# Altium schematic sheet BoardTop.SchDoc
size A3; SheetNumber: 1; SheetTotal: 15
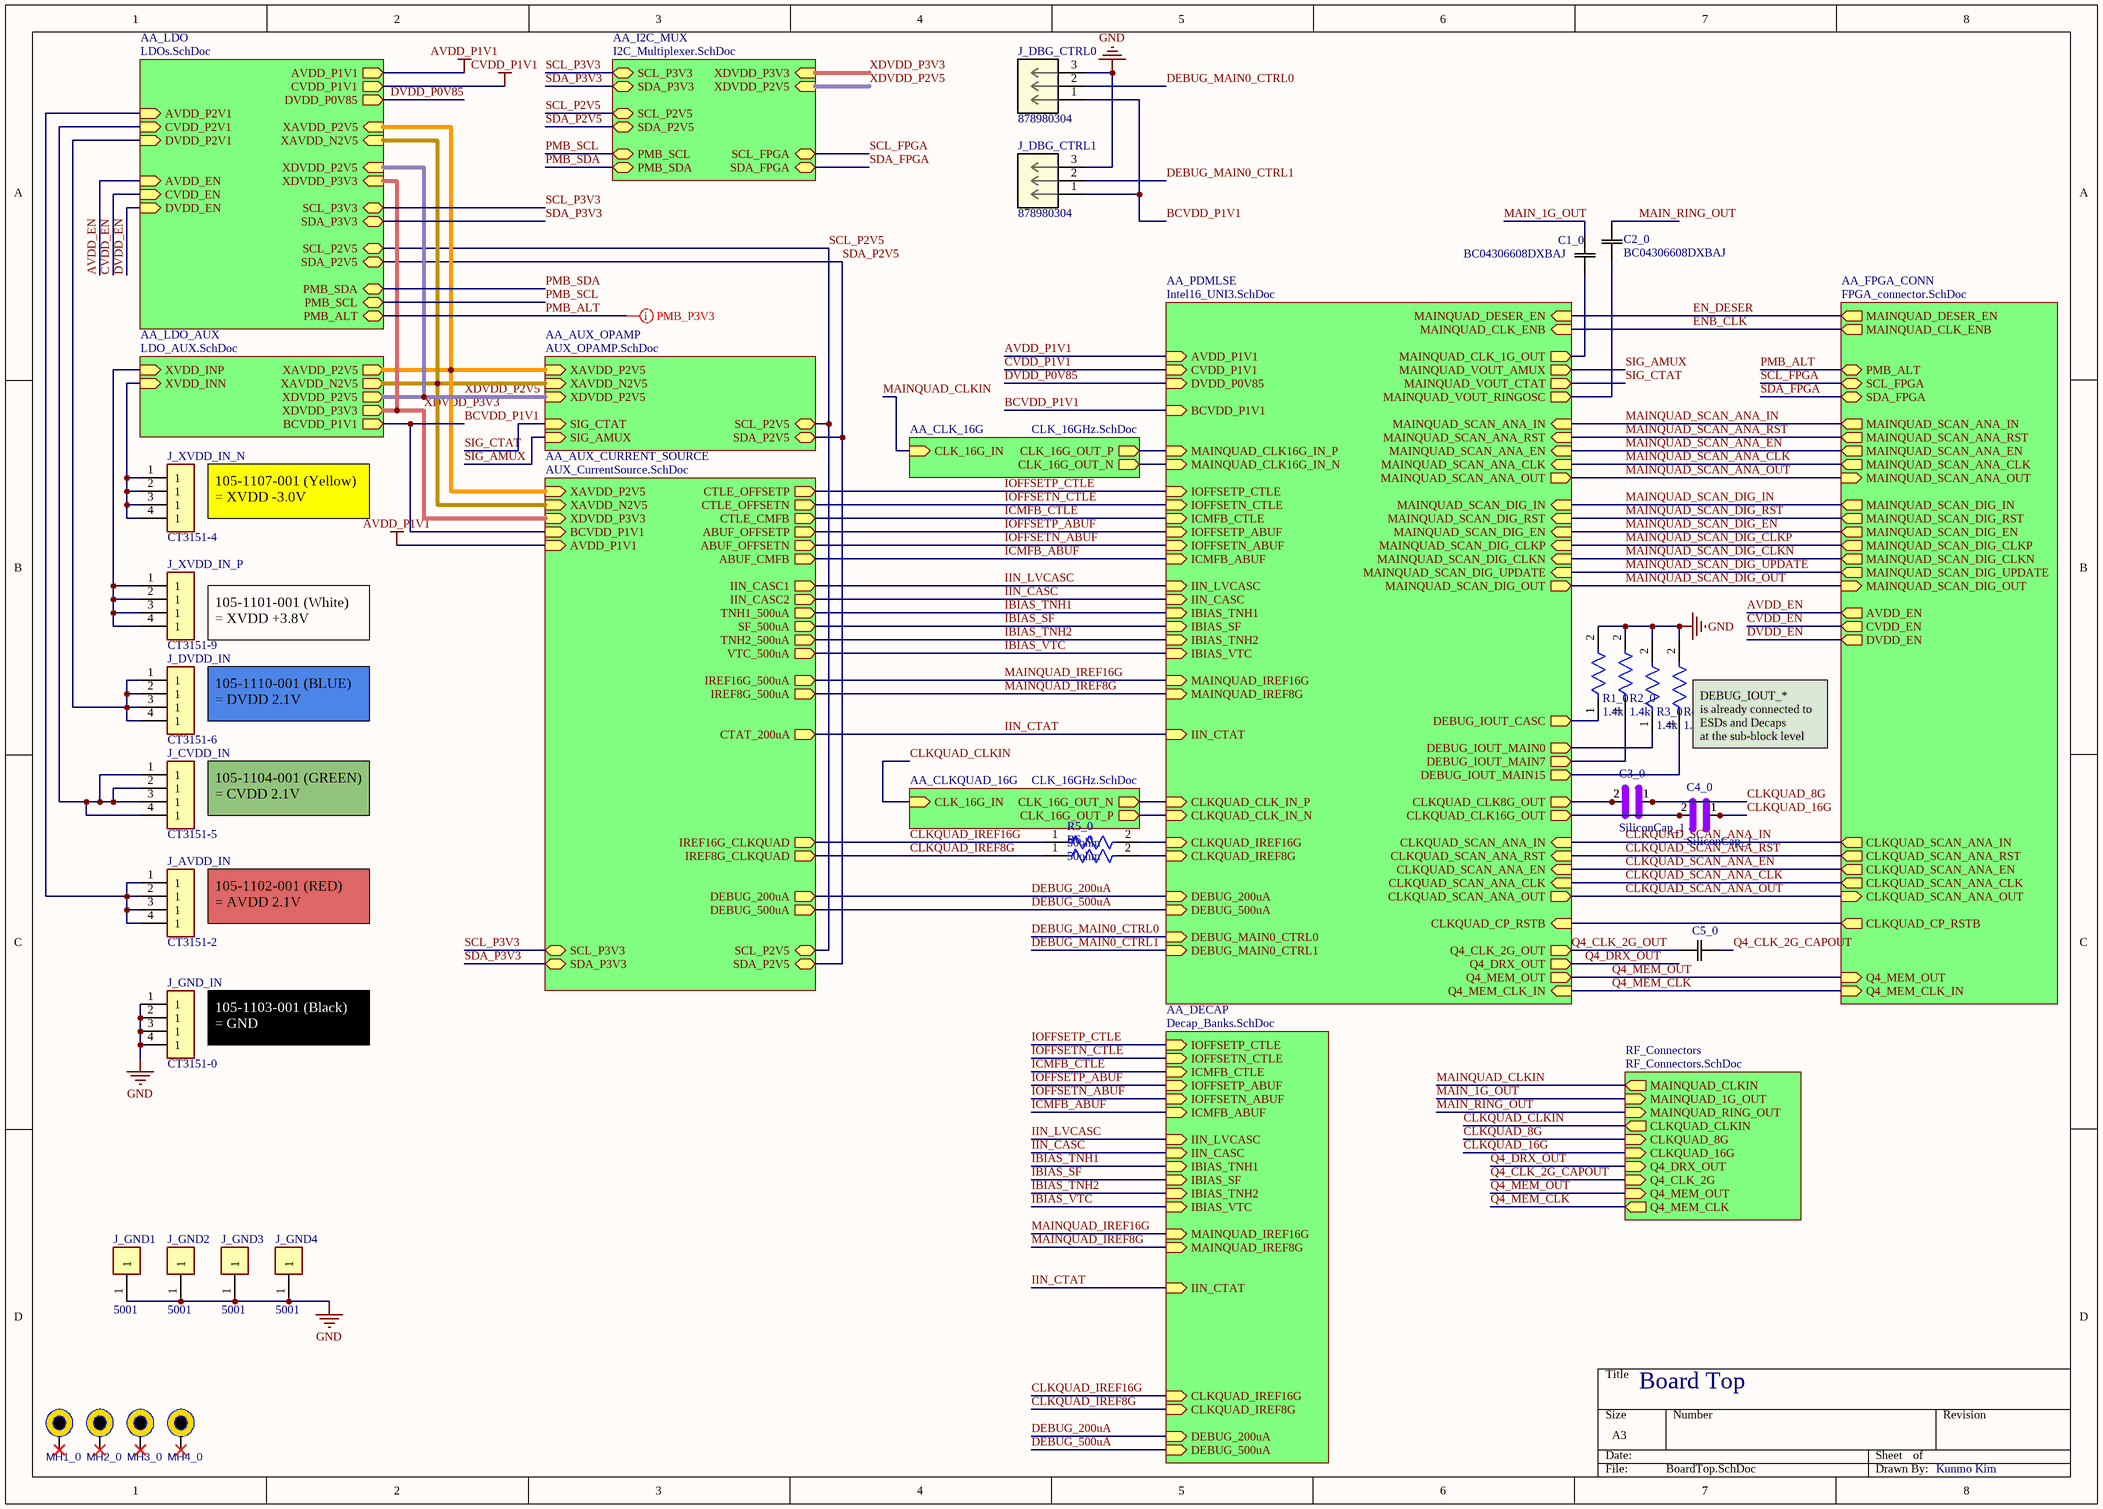
[diagram p0: BoardTop.SchDoc]

## Parts
C1_0  BC04306608DXBAJ  [CAP_BC04_VIS]
C2_0  BC04306608DXBAJ  [CAP_BC04_VIS]
C3_0  SiliconCap_1  [0201-NOSILK]
C4_0  SiliconCap_1  [0201-NOSILK]
C5_0  BC04306608DXBAJ  [CAP_BC04_VIS]  (value not drawn)
J_AVDD_IN  CT3151-2  [CALTEST_CT3151-2]
J_CVDD_IN  CT3151-5  [CALTEST_CT3151-2]
J_DBG_CTRL0  878980304  [CONN03_87898_M-5p84_MOL]
J_DBG_CTRL1  878980304  [CONN03_87898_M-5p84_MOL]
J_DVDD_IN  CT3151-6  [CALTEST_CT3151-2]
J_GND1  5001  [FP-5001-MFG]
J_GND2  5001  [FP-5001-MFG]
J_GND3  5001  [FP-5001-MFG]
J_GND4  5001  [FP-5001-MFG]
J_GND_IN  CT3151-0  [CALTEST_CT3151-0]
J_XVDD_IN_N  CT3151-4  [CALTEST_CT3151-2]
J_XVDD_IN_P  CT3151-9  [CALTEST_CT3151-2]
MH1_0  MTG  [MTG-3.2/6.5-PTH]  (value not drawn)
MH2_0  MTG  [MTG-3.2/6.5-PTH]  (value not drawn)
MH3_0  MTG  [MTG-3.2/6.5-PTH]  (value not drawn)
MH4_0  MTG  [MTG-3.2/6.5-PTH]  (value not drawn)
R1_0  1.4k  [FP-CRCW1206-e3-IPC_B]
R2_0  1.4k  [FP-CRCW1206-e3-IPC_B]
R3_0  1.4k  [FP-CRCW1206-e3-IPC_B]
R4_0  1.4k  [FP-CRCW1206-e3-IPC_B]
R5_0  50ohm  [FP-RT0402-0_35-IPC_A]
R6_0  50ohm  [FP-RT0402-0_35-IPC_A]

## Sub-sheets
AA_AUX_CURRENT_SOURCE = AUX_CurrentSource.SchDoc: BCVDD_P1V1 (in), XAVDD_N2V5 (in), XAVDD_P2V5 (in), CTLE_CMFB (out), TNH1_500uA (out), IREF8G_500uA (out), ABUF_CMFB (out), IREF16G_500uA (out), SF_500uA (out), IIN_CASC1 (out), TNH2_500uA (out), IIN_CASC2 (out), ABUF_OFFSETN (out), ABUF_OFFSETP (out), VTC_500uA (out), CTAT_200uA (out), CTLE_OFFSETN (out), CTLE_OFFSETP (out), XDVDD_P3V3 (in), SCL_P2V5 (bidir), SDA_P2V5 (bidir), DEBUG_500uA (out), DEBUG_200uA (out), IREF16G_CLKQUAD (out), IREF8G_CLKQUAD (out), AVDD_P1V1 (in), SCL_P3V3 (bidir), SDA_P3V3 (bidir)
AA_AUX_OPAMP = AUX_OPAMP.SchDoc: XDVDD_P2V5 (in), XAVDD_P2V5 (in), XAVDD_N2V5 (in), SCL_P2V5 (bidir), SDA_P2V5 (bidir), SIG_AMUX (in), SIG_CTAT (in)
AA_CLK_16G = CLK_16GHz.SchDoc: CLK_16G_OUT_P (out), CLK_16G_IN (in), CLK_16G_OUT_N (out)
AA_CLKQUAD_16G = CLK_16GHz.SchDoc: CLK_16G_OUT_P (out), CLK_16G_IN (in), CLK_16G_OUT_N (out)
AA_DECAP = Decap_Banks.SchDoc: DEBUG_500uA (in), CLKQUAD_IREF8G (in), IIN_CTAT (in), MAINQUAD_IREF16G (in), ICMFB_ABUF (in), IOFFSETN_ABUF (in), IOFFSETP_ABUF (in), ICMFB_CTLE (in), IOFFSETN_CTLE (in), IOFFSETP_CTLE (in), IIN_LVCASC (in), IIN_CASC (in), IBIAS_TNH1 (in), IBIAS_SF (in), IBIAS_TNH2 (in), IBIAS_VTC (in), MAINQUAD_IREF8G (in), CLKQUAD_IREF16G (in), DEBUG_200uA (in)
AA_FPGA_CONN = FPGA_connector.SchDoc: MAINQUAD_SCAN_ANA_IN (out), MAINQUAD_SCAN_ANA_RST (out), MAINQUAD_SCAN_ANA_EN (out), MAINQUAD_SCAN_ANA_CLK (out), MAINQUAD_SCAN_ANA_OUT (in), MAINQUAD_SCAN_DIG_IN (out), MAINQUAD_SCAN_DIG_RST (out), MAINQUAD_SCAN_DIG_EN (out), MAINQUAD_SCAN_DIG_CLKP (out), MAINQUAD_SCAN_DIG_CLKN (out), MAINQUAD_SCAN_DIG_UPDATE (out), MAINQUAD_SCAN_DIG_OUT (in), CLKQUAD_SCAN_ANA_EN (out), CLKQUAD_SCAN_ANA_RST (out), CLKQUAD_SCAN_ANA_CLK (out), CLKQUAD_SCAN_ANA_IN (out), CLKQUAD_SCAN_ANA_OUT (in), Q4_MEM_OUT (in), Q4_MEM_CLK_IN (in), AVDD_EN (out), CVDD_EN (out), DVDD_EN (out), SCL_FPGA (bidir), SDA_FPGA (bidir), PMB_ALT (bidir), CLKQUAD_CP_RSTB (out), MAINQUAD_DESER_EN (out), MAINQUAD_CLK_ENB (out)
AA_I2C_MUX = I2C_Multiplexer.SchDoc: SCL_P3V3 (bidir), SDA_P3V3 (bidir), SCL_P2V5 (bidir), SDA_P2V5 (bidir), PMB_SCL (bidir), PMB_SDA (bidir), SCL_FPGA (bidir), SDA_FPGA (bidir), XDVDD_P3V3 (in), XDVDD_P2V5 (in)
AA_LDO = LDOs.SchDoc: XAVDD_P2V5 (in), XDVDD_P3V3 (in), XAVDD_N2V5 (in), XDVDD_P2V5 (in), AVDD_P2V1 (in), AVDD_EN (in), SCL_P2V5 (bidir), SDA_P2V5 (bidir), CVDD_P1V1 (out), CVDD_P2V1 (in), CVDD_EN (in), DVDD_P0V85 (out), DVDD_EN (in), DVDD_P2V1 (in), PMB_SDA (bidir), PMB_SCL (bidir), PMB_ALT (bidir), SCL_P3V3 (bidir), SDA_P3V3 (bidir), AVDD_P1V1 (out)
AA_LDO_AUX = LDO_AUX.SchDoc: XAVDD_P2V5 (out), XVDD_INN (in), XVDD_INP (in), XAVDD_N2V5 (out), XDVDD_P2V5 (out), XDVDD_P3V3 (out), BCVDD_P1V1 (out)
AA_PDMLSE = Intel16_UNI3.SchDoc: Q4_CLK_2G_OUT (out), Q4_DRX_OUT (out), Q4_MEM_OUT (out), CLKQUAD_CLK8G_OUT (out), CLKQUAD_CLK16G_OUT (out), CLKQUAD_CP_RSTB (in), CLKQUAD_SCAN_ANA_EN (in), CLKQUAD_SCAN_ANA_RST (in), CLKQUAD_SCAN_ANA_CLK (in), CLKQUAD_SCAN_ANA_IN (in), CLKQUAD_SCAN_ANA_OUT (out), MAINQUAD_VOUT_AMUX (out), MAINQUAD_CLK_1G_OUT (out), MAINQUAD_VOUT_CTAT (out), MAINQUAD_VOUT_RINGOSC (out), MAINQUAD_SCAN_ANA_IN (in), MAINQUAD_SCAN_ANA_RST (in), MAINQUAD_SCAN_ANA_EN (in), MAINQUAD_SCAN_ANA_CLK (in), MAINQUAD_SCAN_ANA_OUT (out), MAINQUAD_SCAN_DIG_IN (in), MAINQUAD_SCAN_DIG_RST (in), MAINQUAD_SCAN_DIG_EN (in), MAINQUAD_SCAN_DIG_CLKP (in), MAINQUAD_SCAN_DIG_CLKN (in), MAINQUAD_SCAN_DIG_UPDATE (in), MAINQUAD_SCAN_DIG_OUT (out), DVDD_P0V85 (in), Q4_MEM_CLK_IN (in), BCVDD_P1V1 (in), CLKQUAD_CLK_IN_P (in), CLKQUAD_CLK_IN_N (in), CLKQUAD_IREF8G (in), CLKQUAD_IREF16G (in), AVDD_P1V1 (in), CVDD_P1V1 (in), MAINQUAD_CLK16G_IN_P (in), MAINQUAD_CLK16G_IN_N (in), MAINQUAD_IREF8G (in), MAINQUAD_IREF16G (in), ICMFB_CTLE (in), IOFFSETP_CTLE (in), IOFFSETN_CTLE (in), ICMFB_ABUF (in), IOFFSETP_ABUF (in), IOFFSETN_ABUF (in), IIN_LVCASC (in), IIN_CASC (in), IBIAS_TNH1 (in), IBIAS_TNH2 (in), IBIAS_SF (in), IBIAS_VTC (in), IIN_CTAT (in), MAINQUAD_DESER_EN (in), DEBUG_200uA (in), DEBUG_500uA (in), DEBUG_MAIN0_CTRL0 (in), DEBUG_MAIN0_CTRL1 (in), DEBUG_IOUT_CASC (out), DEBUG_IOUT_MAIN0 (out), DEBUG_IOUT_MAIN7 (out), DEBUG_IOUT_MAIN15 (out), MAINQUAD_CLK_ENB (in)
RF_Connectors = RF_Connectors.SchDoc: MAINQUAD_CLKIN (out), MAINQUAD_1G_OUT (in), MAINQUAD_RING_OUT (in), CLKQUAD_CLKIN (out), CLKQUAD_8G (in), CLKQUAD_16G (in), Q4_DRX_OUT (in), Q4_CLK_2G (in), Q4_MEM_OUT (in), Q4_MEM_CLK (out)

## Nets
AVDD_P1V1: sheet AA_LDO/AVDD_P1V1, sheet AA_AUX_CURRENT_SOURCE/AVDD_P1V1, sheet AA_PDMLSE/AVDD_P1V1
CVDD_P1V1: sheet AA_LDO/CVDD_P1V1, sheet AA_PDMLSE/CVDD_P1V1
GND: J_DBG_CTRL0.3 J_DBG_CTRL1.3 J_GND1.1 J_GND2.1 J_GND3.1 J_GND4.1 J_GND_IN.1 J_GND_IN.2(1) J_GND_IN.3(1) J_GND_IN.4(1) R1_0.2 R2_0.2 R3_0.2 R4_0.2
AVDD_EN: sheet AA_LDO/AVDD_EN, sheet AA_FPGA_CONN/AVDD_EN
BCVDD_P1V1: J_DBG_CTRL0.1 J_DBG_CTRL1.1 ; sheet AA_LDO_AUX/BCVDD_P1V1, sheet AA_AUX_CURRENT_SOURCE/BCVDD_P1V1, sheet AA_PDMLSE/BCVDD_P1V1
CLKQUAD_8G: C3_0.1 ; sheet RF_Connectors/CLKQUAD_8G
CLKQUAD_16G: C4_0.1 ; sheet RF_Connectors/CLKQUAD_16G
CLKQUAD_CLKIN: sheet AA_CLKQUAD_16G/CLK_16G_IN, sheet RF_Connectors/CLKQUAD_CLKIN
CLKQUAD_IREF8G: R6_0.1 ; sheet AA_AUX_CURRENT_SOURCE/IREF8G_CLKQUAD, sheet AA_DECAP/CLKQUAD_IREF8G
CLKQUAD_IREF16G: R5_0.1 ; sheet AA_AUX_CURRENT_SOURCE/IREF16G_CLKQUAD, sheet AA_DECAP/CLKQUAD_IREF16G
CLKQUAD_SCAN_ANA_CLK: sheet AA_PDMLSE/CLKQUAD_SCAN_ANA_CLK, sheet AA_FPGA_CONN/CLKQUAD_SCAN_ANA_CLK
CLKQUAD_SCAN_ANA_EN: sheet AA_PDMLSE/CLKQUAD_SCAN_ANA_EN, sheet AA_FPGA_CONN/CLKQUAD_SCAN_ANA_EN
CLKQUAD_SCAN_ANA_IN: sheet AA_PDMLSE/CLKQUAD_SCAN_ANA_IN, sheet AA_FPGA_CONN/CLKQUAD_SCAN_ANA_IN
CLKQUAD_SCAN_ANA_OUT: sheet AA_PDMLSE/CLKQUAD_SCAN_ANA_OUT, sheet AA_FPGA_CONN/CLKQUAD_SCAN_ANA_OUT
CLKQUAD_SCAN_ANA_RST: sheet AA_PDMLSE/CLKQUAD_SCAN_ANA_RST, sheet AA_FPGA_CONN/CLKQUAD_SCAN_ANA_RST
CVDD_EN: sheet AA_LDO/CVDD_EN, sheet AA_FPGA_CONN/CVDD_EN
DEBUG_200uA: sheet AA_AUX_CURRENT_SOURCE/DEBUG_200uA, sheet AA_PDMLSE/DEBUG_200uA, sheet AA_DECAP/DEBUG_200uA
DEBUG_500uA: sheet AA_AUX_CURRENT_SOURCE/DEBUG_500uA, sheet AA_PDMLSE/DEBUG_500uA, sheet AA_DECAP/DEBUG_500uA
DEBUG_MAIN0_CTRL0: J_DBG_CTRL0.2 ; sheet AA_PDMLSE/DEBUG_MAIN0_CTRL0
DEBUG_MAIN0_CTRL1: J_DBG_CTRL1.2 ; sheet AA_PDMLSE/DEBUG_MAIN0_CTRL1
DVDD_EN: sheet AA_LDO/DVDD_EN, sheet AA_FPGA_CONN/DVDD_EN
DVDD_P0V85: sheet AA_LDO/DVDD_P0V85, sheet AA_PDMLSE/DVDD_P0V85
EN_DESER: sheet AA_PDMLSE/MAINQUAD_DESER_EN, sheet AA_FPGA_CONN/MAINQUAD_DESER_EN
ENB_CLK: sheet AA_PDMLSE/MAINQUAD_CLK_ENB, sheet AA_FPGA_CONN/MAINQUAD_CLK_ENB
IBIAS_SF: sheet AA_AUX_CURRENT_SOURCE/SF_500uA, sheet AA_PDMLSE/IBIAS_SF, sheet AA_DECAP/IBIAS_SF
IBIAS_TNH1: sheet AA_AUX_CURRENT_SOURCE/TNH1_500uA, sheet AA_PDMLSE/IBIAS_TNH1, sheet AA_DECAP/IBIAS_TNH1
IBIAS_TNH2: sheet AA_AUX_CURRENT_SOURCE/TNH2_500uA, sheet AA_PDMLSE/IBIAS_TNH2, sheet AA_DECAP/IBIAS_TNH2
IBIAS_VTC: sheet AA_AUX_CURRENT_SOURCE/VTC_500uA, sheet AA_PDMLSE/IBIAS_VTC, sheet AA_DECAP/IBIAS_VTC
ICMFB_ABUF: sheet AA_AUX_CURRENT_SOURCE/ABUF_CMFB, sheet AA_PDMLSE/ICMFB_ABUF, sheet AA_DECAP/ICMFB_ABUF
ICMFB_CTLE: sheet AA_AUX_CURRENT_SOURCE/CTLE_CMFB, sheet AA_PDMLSE/ICMFB_CTLE, sheet AA_DECAP/ICMFB_CTLE
IIN_CASC: sheet AA_AUX_CURRENT_SOURCE/IIN_CASC2, sheet AA_PDMLSE/IIN_CASC, sheet AA_DECAP/IIN_CASC
IIN_CTAT: sheet AA_AUX_CURRENT_SOURCE/CTAT_200uA, sheet AA_PDMLSE/IIN_CTAT, sheet AA_DECAP/IIN_CTAT
IIN_LVCASC: sheet AA_AUX_CURRENT_SOURCE/IIN_CASC1, sheet AA_PDMLSE/IIN_LVCASC, sheet AA_DECAP/IIN_LVCASC
IOFFSETN_ABUF: sheet AA_AUX_CURRENT_SOURCE/ABUF_OFFSETN, sheet AA_PDMLSE/IOFFSETN_ABUF, sheet AA_DECAP/IOFFSETN_ABUF
IOFFSETN_CTLE: sheet AA_AUX_CURRENT_SOURCE/CTLE_OFFSETN, sheet AA_PDMLSE/IOFFSETN_CTLE, sheet AA_DECAP/IOFFSETN_CTLE
IOFFSETP_ABUF: sheet AA_AUX_CURRENT_SOURCE/ABUF_OFFSETP, sheet AA_PDMLSE/IOFFSETP_ABUF, sheet AA_DECAP/IOFFSETP_ABUF
IOFFSETP_CTLE: sheet AA_AUX_CURRENT_SOURCE/CTLE_OFFSETP, sheet AA_PDMLSE/IOFFSETP_CTLE, sheet AA_DECAP/IOFFSETP_CTLE
MAIN_1G_OUT: C1_0.2 ; sheet RF_Connectors/MAINQUAD_1G_OUT
MAIN_RING_OUT: C2_0.2 ; sheet RF_Connectors/MAINQUAD_RING_OUT
MAINQUAD_CLKIN: sheet AA_CLK_16G/CLK_16G_IN, sheet RF_Connectors/MAINQUAD_CLKIN
MAINQUAD_IREF8G: sheet AA_AUX_CURRENT_SOURCE/IREF8G_500uA, sheet AA_PDMLSE/MAINQUAD_IREF8G, sheet AA_DECAP/MAINQUAD_IREF8G
MAINQUAD_IREF16G: sheet AA_AUX_CURRENT_SOURCE/IREF16G_500uA, sheet AA_PDMLSE/MAINQUAD_IREF16G, sheet AA_DECAP/MAINQUAD_IREF16G
MAINQUAD_SCAN_ANA_CLK: sheet AA_PDMLSE/MAINQUAD_SCAN_ANA_CLK, sheet AA_FPGA_CONN/MAINQUAD_SCAN_ANA_CLK
MAINQUAD_SCAN_ANA_EN: sheet AA_PDMLSE/MAINQUAD_SCAN_ANA_EN, sheet AA_FPGA_CONN/MAINQUAD_SCAN_ANA_EN
MAINQUAD_SCAN_ANA_IN: sheet AA_PDMLSE/MAINQUAD_SCAN_ANA_IN, sheet AA_FPGA_CONN/MAINQUAD_SCAN_ANA_IN
MAINQUAD_SCAN_ANA_OUT: sheet AA_PDMLSE/MAINQUAD_SCAN_ANA_OUT, sheet AA_FPGA_CONN/MAINQUAD_SCAN_ANA_OUT
MAINQUAD_SCAN_ANA_RST: sheet AA_PDMLSE/MAINQUAD_SCAN_ANA_RST, sheet AA_FPGA_CONN/MAINQUAD_SCAN_ANA_RST
MAINQUAD_SCAN_DIG_CLKN: sheet AA_PDMLSE/MAINQUAD_SCAN_DIG_CLKN, sheet AA_FPGA_CONN/MAINQUAD_SCAN_DIG_CLKN
MAINQUAD_SCAN_DIG_CLKP: sheet AA_PDMLSE/MAINQUAD_SCAN_DIG_CLKP, sheet AA_FPGA_CONN/MAINQUAD_SCAN_DIG_CLKP
MAINQUAD_SCAN_DIG_EN: sheet AA_PDMLSE/MAINQUAD_SCAN_DIG_EN, sheet AA_FPGA_CONN/MAINQUAD_SCAN_DIG_EN
MAINQUAD_SCAN_DIG_IN: sheet AA_PDMLSE/MAINQUAD_SCAN_DIG_IN, sheet AA_FPGA_CONN/MAINQUAD_SCAN_DIG_IN
MAINQUAD_SCAN_DIG_OUT: sheet AA_PDMLSE/MAINQUAD_SCAN_DIG_OUT, sheet AA_FPGA_CONN/MAINQUAD_SCAN_DIG_OUT
MAINQUAD_SCAN_DIG_RST: sheet AA_PDMLSE/MAINQUAD_SCAN_DIG_RST, sheet AA_FPGA_CONN/MAINQUAD_SCAN_DIG_RST
MAINQUAD_SCAN_DIG_UPDATE: sheet AA_PDMLSE/MAINQUAD_SCAN_DIG_UPDATE, sheet AA_FPGA_CONN/MAINQUAD_SCAN_DIG_UPDATE
PMB_ALT: sheet AA_LDO/PMB_ALT, sheet AA_FPGA_CONN/PMB_ALT
PMB_SCL: sheet AA_LDO/PMB_SCL, sheet AA_I2C_MUX/PMB_SCL
PMB_SDA: sheet AA_LDO/PMB_SDA, sheet AA_I2C_MUX/PMB_SDA
Q4_CLK_2G_CAPOUT: C5_0.2 ; sheet RF_Connectors/Q4_CLK_2G
Q4_CLK_2G_OUT: C5_0.1 ; sheet AA_PDMLSE/Q4_CLK_2G_OUT
Q4_DRX_OUT: sheet AA_PDMLSE/Q4_DRX_OUT, sheet RF_Connectors/Q4_DRX_OUT
Q4_MEM_CLK: sheet AA_PDMLSE/Q4_MEM_CLK_IN, sheet AA_FPGA_CONN/Q4_MEM_CLK_IN, sheet RF_Connectors/Q4_MEM_CLK
Q4_MEM_OUT: sheet AA_PDMLSE/Q4_MEM_OUT, sheet AA_FPGA_CONN/Q4_MEM_OUT, sheet RF_Connectors/Q4_MEM_OUT
SCL_FPGA: sheet AA_FPGA_CONN/SCL_FPGA, sheet AA_I2C_MUX/SCL_FPGA
SCL_P2V5: sheet AA_LDO/SCL_P2V5, sheet AA_AUX_OPAMP/SCL_P2V5, sheet AA_AUX_CURRENT_SOURCE/SCL_P2V5, sheet AA_I2C_MUX/SCL_P2V5
SCL_P3V3: sheet AA_LDO/SCL_P3V3, sheet AA_AUX_CURRENT_SOURCE/SCL_P3V3, sheet AA_I2C_MUX/SCL_P3V3
SDA_FPGA: sheet AA_FPGA_CONN/SDA_FPGA, sheet AA_I2C_MUX/SDA_FPGA
SDA_P2V5: sheet AA_LDO/SDA_P2V5, sheet AA_AUX_OPAMP/SDA_P2V5, sheet AA_AUX_CURRENT_SOURCE/SDA_P2V5, sheet AA_I2C_MUX/SDA_P2V5
SDA_P3V3: sheet AA_LDO/SDA_P3V3, sheet AA_AUX_CURRENT_SOURCE/SDA_P3V3, sheet AA_I2C_MUX/SDA_P3V3
SIG_AMUX: sheet AA_AUX_OPAMP/SIG_AMUX, sheet AA_PDMLSE/MAINQUAD_VOUT_AMUX
SIG_CTAT: sheet AA_AUX_OPAMP/SIG_CTAT, sheet AA_PDMLSE/MAINQUAD_VOUT_CTAT
XDVDD_P2V5: sheet AA_LDO/XDVDD_P2V5, sheet AA_LDO_AUX/XDVDD_P2V5, sheet AA_AUX_OPAMP/XDVDD_P2V5, sheet AA_I2C_MUX/XDVDD_P2V5
XDVDD_P3V3: sheet AA_LDO/XDVDD_P3V3, sheet AA_LDO_AUX/XDVDD_P3V3, sheet AA_AUX_CURRENT_SOURCE/XDVDD_P3V3, sheet AA_I2C_MUX/XDVDD_P3V3
NetC1_0_1: C1_0.1 ; sheet AA_PDMLSE/MAINQUAD_CLK_1G_OUT
NetC2_0_1: C2_0.1 ; sheet AA_PDMLSE/MAINQUAD_VOUT_RINGOSC
NetC3_0_2: C3_0.2 ; sheet AA_PDMLSE/CLKQUAD_CLK8G_OUT
NetC4_0_2: C4_0.2 ; sheet AA_PDMLSE/CLKQUAD_CLK16G_OUT
NetJ_AVDD_IN_1: J_AVDD_IN.1 J_AVDD_IN.2(1) J_AVDD_IN.3(1) J_AVDD_IN.4(1) ; sheet AA_LDO/AVDD_P2V1
NetJ_CVDD_IN_1: J_CVDD_IN.1 J_CVDD_IN.2(1) J_CVDD_IN.3(1) J_CVDD_IN.4(1) ; sheet AA_LDO/CVDD_P2V1
NetJ_DVDD_IN_1: J_DVDD_IN.1 J_DVDD_IN.2(1) J_DVDD_IN.3(1) J_DVDD_IN.4(1) ; sheet AA_LDO/DVDD_P2V1
NetJ_XVDD_IN_N_1: J_XVDD_IN_N.1 J_XVDD_IN_N.2(1) J_XVDD_IN_N.3(1) J_XVDD_IN_N.4(1) ; sheet AA_LDO_AUX/XVDD_INN
NetJ_XVDD_IN_P_1: J_XVDD_IN_P.1 J_XVDD_IN_P.2(1) J_XVDD_IN_P.3(1) J_XVDD_IN_P.4(1) ; sheet AA_LDO_AUX/XVDD_INP
NetR1_0_1: R1_0.1 ; sheet AA_PDMLSE/DEBUG_IOUT_CASC
NetR2_0_1: R2_0.1 ; sheet AA_PDMLSE/DEBUG_IOUT_MAIN7
NetR3_0_1: R3_0.1 ; sheet AA_PDMLSE/DEBUG_IOUT_MAIN0
NetR4_0_1: R4_0.1 ; sheet AA_PDMLSE/DEBUG_IOUT_MAIN15
NetR5_0_2: R5_0.2 ; sheet AA_PDMLSE/CLKQUAD_IREF16G
NetR6_0_2: R6_0.2 ; sheet AA_PDMLSE/CLKQUAD_IREF8G
(unnamed): sheet AA_LDO/XAVDD_P2V5, sheet AA_LDO_AUX/XAVDD_P2V5, sheet AA_AUX_OPAMP/XAVDD_P2V5, sheet AA_AUX_CURRENT_SOURCE/XAVDD_P2V5
(unnamed): sheet AA_LDO/XAVDD_N2V5, sheet AA_LDO_AUX/XAVDD_N2V5, sheet AA_AUX_OPAMP/XAVDD_N2V5, sheet AA_AUX_CURRENT_SOURCE/XAVDD_N2V5
(unnamed): sheet AA_PDMLSE/CLKQUAD_CP_RSTB, sheet AA_FPGA_CONN/CLKQUAD_CP_RSTB
(unnamed): sheet AA_PDMLSE/CLKQUAD_CLK_IN_P, sheet AA_CLKQUAD_16G/CLK_16G_OUT_N
(unnamed): sheet AA_PDMLSE/CLKQUAD_CLK_IN_N, sheet AA_CLKQUAD_16G/CLK_16G_OUT_P
(unnamed): sheet AA_PDMLSE/MAINQUAD_CLK16G_IN_P, sheet AA_CLK_16G/CLK_16G_OUT_P
(unnamed): sheet AA_PDMLSE/MAINQUAD_CLK16G_IN_N, sheet AA_CLK_16G/CLK_16G_OUT_N

Not connected (* = marked no-connect by the designer): MH1_0 1*; MH2_0 1*; MH3_0 1*; MH4_0 1*

## Layout directives
net class PMB_P3V3: PMB_ALT

## Notes on the sheet
- (near J_XVDD_IN_N) 105-1107-001 (Yellow)
  = XVDD -3.0V
- 105-1101-001 (White)
  = XVDD +3.8V
- 105-1110-001 (BLUE)
  = DVDD 2.1V
- (near R4_0) DEBUG_IOUT_*
  is already connected to
  ESDs and Decaps
  at the sub-block level
- 105-1104-001 (GREEN)
  = CVDD 2.1V
- (near J_AVDD_IN) 105-1102-001 (RED)
  = AVDD 2.1V
- (near J_GND_IN) 105-1103-001 (Black)
  = GND
- Board Top
- Kunmo Kim

## Library data of the parts
C1_0 C2_0 C5_0 = BC04306608DXBAJ: No Description Available; Mfr_Name: Vishay; Supplier 1: Mouser; Supplier Part Number 1: 77-BC04306608DXBAJ
C3_0 C4_0 = SiliconCap_1: 939114492510-T3S from Murata; Supplier 1: Digikey; Supplier Part Number 1: 490-939114492510-T3SCT-ND
J_AVDD_IN = CT3151-2: Banana Jack Connector Standard Banana Solder Red; MF: Cal Test; SnapEDA_Link: https://www.snapeda.com/parts/CT3151-2/Cal+Test+Electronics/view-part/?ref=snap; Package: None; Value: *; MP: CT3151-2; Check_prices: https://www.snapeda.com/parts/CT3151-2/Cal+Test+Electronics/view-part/?ref=eda; Supplier 1: Digikey; Supplier Part Number 1: BKCT3151-2-ND; ClassName: InputPowerComponent
J_CVDD_IN = CT3151-5: Banana Jack Connector Standard Banana Solder Green; MF: Cal Test; MP: CT3151-2; SnapEDA_Link: https://www.snapeda.com/parts/CT3151-2/Cal+Test+Electronics/view-part/?ref=snap; Package: None; Value: *; Check_prices: https://www.snapeda.com/parts/CT3151-2/Cal+Test+Electronics/view-part/?ref=eda; Supplier 1: Digikey; Supplier Part Number 1: BKCT3151-5-ND; ClassName: InputPowerComponent
J_DBG_CTRL0 J_DBG_CTRL1 = 878980304: No Description Available; Mfr_Name: Molex Connector Corporation; RefDes: RefDes; Type: Type
J_DVDD_IN = CT3151-6: Banana Jack Connector Standard Banana Solder Green; MF: Cal Test; MP: CT3151-2; SnapEDA_Link: https://www.snapeda.com/parts/CT3151-2/Cal+Test+Electronics/view-part/?ref=snap; Package: None; Value: *; Check_prices: https://www.snapeda.com/parts/CT3151-2/Cal+Test+Electronics/view-part/?ref=eda; Supplier 1: Digikey; Supplier Part Number 1: BKCT3151-6-ND; ClassName: InputPowerComponent
J_GND1-J_GND4 = CMP-2000-05181-2: PC TEST POINT MINIATURE BLACK; Body Material: Bronze; Plating: Silver; Inside Diameter: 1.27mm; Hole Diameter: 1.6mm; Number of Ports: 1; Outside Diameter: 2.54mm; Insulation: Insulated; Insulation Material: Nylon; Mount: Through Hole; RoHS Compliant: Yes; Series: THM; Height: 0.3inch; Termination: Through Hole; Material: Nylon; Packaging: Bulk; Contact Material: Bronze; REACH SVHC: No SVHC; Contact Plating: Silver; Orientation: Straight; Lead Free: Lead Free; Package Quantity: 100; Length: 7.62mm; Flammability Rating: UL94 V-0; Number of Contacts: 1; Diameter: 2.54mm; Housing Color: Black; Color: Black
J_GND_IN = CT3151-0: Banana Jack Connector Standard Banana Solder Black; MF: Cal Test; MP: CT3151-2; SnapEDA_Link: https://www.snapeda.com/parts/CT3151-2/Cal+Test+Electronics/view-part/?ref=snap; Package: None; Value: *; Check_prices: https://www.snapeda.com/parts/CT3151-2/Cal+Test+Electronics/view-part/?ref=eda; Supplier 1: Digikey; Supplier Part Number 1: BKCT3151-0-ND; ClassName: InputPowerComponent
J_XVDD_IN_N = CT3151-4: Banana Jack Connector Standard Banana Solder Yellow; MF: Cal Test; MP: CT3151-2; SnapEDA_Link: https://www.snapeda.com/parts/CT3151-2/Cal+Test+Electronics/view-part/?ref=snap; Package: None; Value: *; Check_prices: https://www.snapeda.com/parts/CT3151-2/Cal+Test+Electronics/view-part/?ref=eda; Supplier 1: Digikey; Supplier Part Number 1: BKCT3151-4-ND; ClassName: InputPowerComponent
J_XVDD_IN_P = CT3151-9: Banana Jack Connector Standard Banana Solder White; MF: Cal Test; MP: CT3151-2; SnapEDA_Link: https://www.snapeda.com/parts/CT3151-2/Cal+Test+Electronics/view-part/?ref=snap; Package: None; Value: *; Check_prices: https://www.snapeda.com/parts/CT3151-2/Cal+Test+Electronics/view-part/?ref=eda; Supplier 1: Digikey; Supplier Part Number 1: BKCT3151-9-ND; ClassName: InputPowerComponent
MH1_0 MH2_0 MH3_0 MH4_0 = MTG: Mounting hole
R1_0 R2_0 R3_0 R4_0 = CMP-2003-01885-2: RES Thick Film, 1.4kΩ, 1%, 0.25W, 100ppm/°C, 1206; Voltage Rating (DC): 200V; Max Power Dissipation: 250mW; Resistance: 1.4kR; Number of Terminations: 2; Height: 0.024inch; Packaging: Tape and Reel; Contact Plating: Tin; Composition: Thick Film; Max Operating Temperature: 155°C; Temperature Coefficient: 100ppm/°C; Case/Package: 1206; Depth: 1.6mm; Case Code (Imperial): 1206; Military Standard: Not; Tolerance: 1%; Min Operating Temperature: -55°C; Power Rating: 250mW; Length: 3.2mm; Case Code (Metric): 3216; Voltage Rating: 200V; Width: 1.6mm; Package Quantity: 5000; Lead Free: Lead Free; Radiation Hardening: No; Features: Automotive AEC-Q200; Weight: 0.000353oz; Number of Pins: 2
R5_0 R6_0 = CMP-00621-71392720-1: RT0402BRE0750RL Fixed Resistor, Thin Film, 0.0625W, 50ohm, 50V, 0.1% +/-Tol, 50ppm/Cel, Surface Mount, 0402; Max Power Dissipation: 63mW; Temperature Coefficient: 50ppm/°C; Resistance: 50Ω; Features: Moisture Resistant; Max Operating Temperature: 155°C; Tolerance: 0.1%; Min Operating Temperature: -55°C; Case/Package: 0402; Packaging: Tape & Reel; RoHS: Compliant; Width: 508µm; Height: 355.6µm; NexarPartId: 71392720; Composition: Thin Film; Length: 990.6µm; Number of Terminations: 2; Supplier 1: Digikey; Supplier Part Number 1: 13-RT0402BRE0750RLCT-ND